# Altium project PCB_Project.PrjPCB
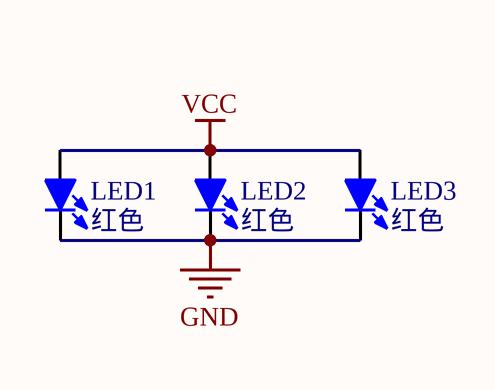
[diagram p0: PCB_Project.SchDoc]
1 sheet, 3 parts. Net scope: global (net labels, ports and power ports of the same name join across sheets).
Board file: PCB_Project.PcbDoc

## Sheet PCB_Project.SchDoc
size A4

### Parts
LED1  红色  [LED 0805B]
LED2  红色  [LED 0805B]
LED3  红色  [LED 0805B]

### Nets
GND: LED1.2(K) LED2.2(K) LED3.2(K)
VCC: LED1.1(A) LED2.1(A) LED3.1(A)

### Library data of the parts
LED1-LED3 = LED-SMD: 贴片LED; 版权归属: 源创客; BOM名称: 贴片LED; 学习资源: www.ooocke.com